# EasyEDA Pro project ProProject_aDataFlow_v2_pub_2024-01-13.epro, board PCB_back
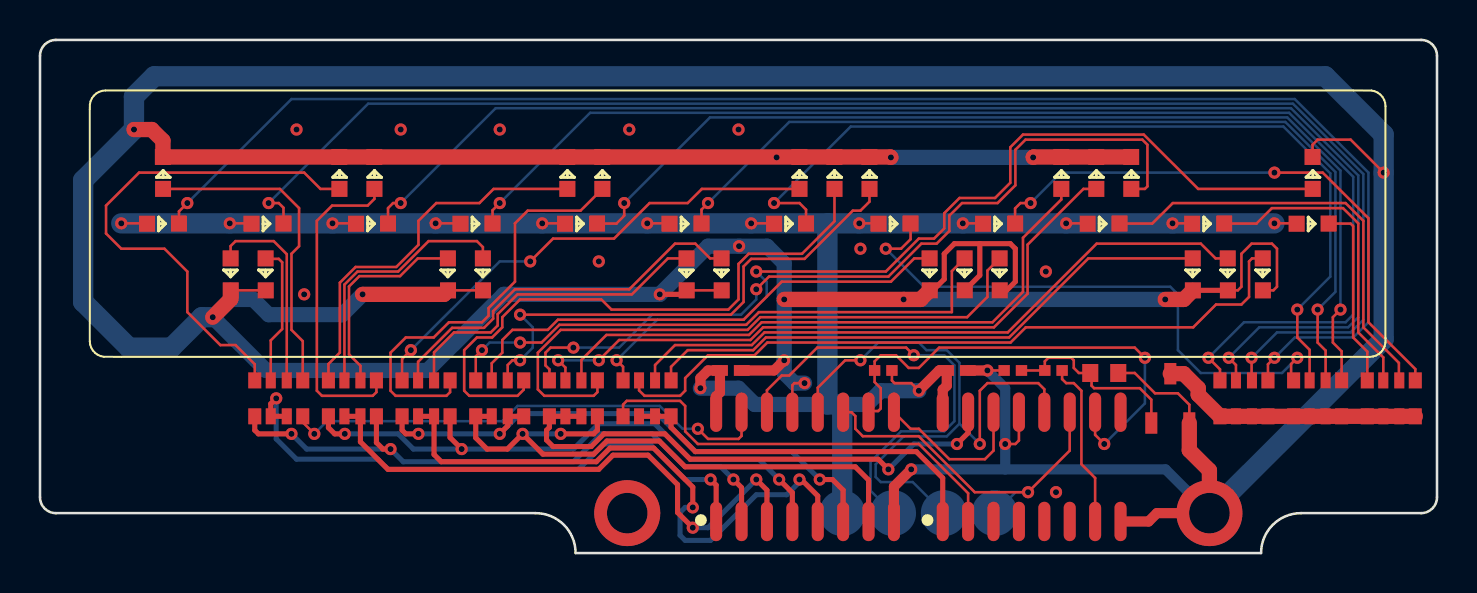
[diagram p9: board, top side]
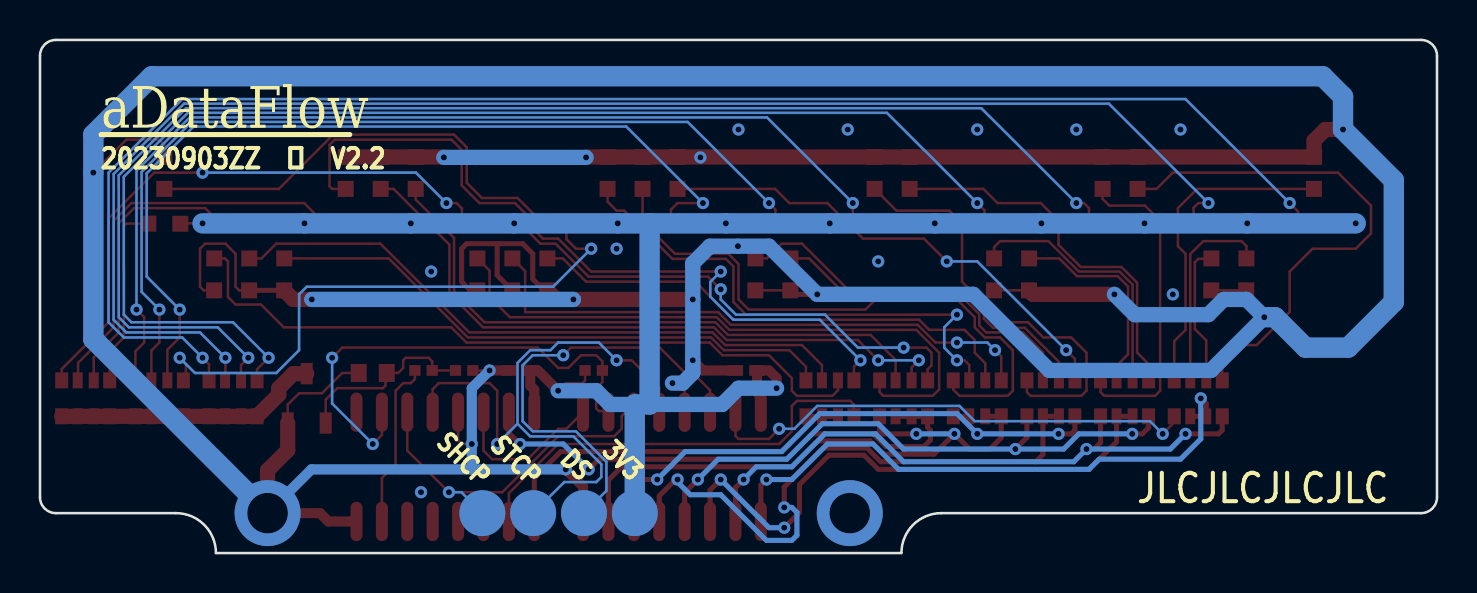
[diagram p10: board, bottom side, seen from below]

Outline 69.85 x 25.69 mm; copper layers: Top Layer, Bottom Layer. Coordinates in mm from the lower left corner of the outline.
Outline path: 0,24.9 arc(0.23,25.46) 0.79,25.69 69.06,25.69 arc(69.62,25.46) 69.85,24.9 69.85,2.79 arc(69.62,2.23) 69.06,2 63.05,2 arc(61.64,1.41) 61.05,0 26.78,0 arc(26.19,1.41) 24.78,2 0.79,2 arc(0.23,2.23) 0,2.79 0,24.9
Stack: Top Layer 0.035mm / Dielectric1 1.51mm FR4 er 4.5 / Bottom Layer 0.035mm

## Design rules (mm)
template: JLCPCB Capability(Two Layers Board)
spacing copperThickness1oz (default): track to track 0.102, other pairs 0.152 to 0.3
spacing copperThickness2oz: track to track 0.203, other pairs 0.152 to 0.3
track width copperThickness1oz (default): min 0.127, default 0.254, max 2.54
track width copperThickness2oz: min 0.203, default 0.254, max 2.54
differential pair differentialPair (default): width min 0.127, default 0.254, max 2.54; gap min 0.152, default 0.152
via viaSize (default): diameter min 0.5, default 0.61, max 10; hole min 0.3, default 0.305, max 6.3

## Placement (name value [footprint] x y rotation side)
C1  100nF  [C0402]  34.54 9.14 0 top
C2  100nF  [C0402]  45.85 9.14 180 top
C3  10uF  [C0603]  53.21 9.02 0 top
LED1  19-213/Y2C-CQ2R2L/3T(CY)  [LED0603-RD-YELLOW]  6.15 19.03 270 top
LED2  19-213/Y2C-CQ2R2L/3T(CY)  [LED0603-RD-YELLOW]  9.53 13.95 90 top
LED3  19-213/Y2C-CQ2R2L/3T(CY)  [LED0603-RD-YELLOW]  11.28 13.95 90 top
LED4  19-213/Y2C-CQ2R2L/3T(CY)  [LED0603-RD-YELLOW]  14.97 19.03 270 top
LED5  19-213/Y2C-CQ2R2L/3T(CY)  [LED0603-RD-YELLOW]  16.72 19.03 270 top
LED6  19-213/Y2C-CQ2R2L/3T(CY)  [LED0603-RD-YELLOW]  20.4 13.95 90 top
LED7  19-213/Y2C-CQ2R2L/3T(CY)  [LED0603-RD-YELLOW]  22.15 13.95 90 top
LED8  19-213/Y2C-CQ2R2L/3T(CY)  [LED0603-RD-YELLOW]  26.36 19.03 270 top
LED9  19-213/Y2C-CQ2R2L/3T(CY)  [LED0603-RD-YELLOW]  28.11 19.03 270 top
LED10  19-213/Y2C-CQ2R2L/3T(CY)  [LED0603-RD-YELLOW]  32.33 13.95 90 top
LED11  19-213/Y2C-CQ2R2L/3T(CY)  [LED0603-RD-YELLOW]  34.08 13.95 90 top
LED12  19-213/Y2C-CQ2R2L/3T(CY)  [LED0603-RD-YELLOW]  37.97 19.03 270 top
LED13  19-213/Y2C-CQ2R2L/3T(CY)  [LED0603-RD-YELLOW]  39.72 19.03 270 top
LED14  19-213/Y2C-CQ2R2L/3T(CY)  [LED0603-RD-YELLOW]  41.47 19.03 270 top
LED15  19-213/Y2C-CQ2R2L/3T(CY)  [LED0603-RD-YELLOW]  44.48 13.95 90 top
LED16  19-213/Y2C-CQ2R2L/3T(CY)  [LED0603-RD-YELLOW]  46.23 13.95 90 top
LED17  19-213/Y2C-CQ2R2L/3T(CY)  [LED0603-RD-YELLOW]  47.98 13.95 90 top
LED18  19-213/Y2C-CQ2R2L/3T(CY)  [LED0603-RD-YELLOW]  51.06 19.03 270 top
LED19  19-213/Y2C-CQ2R2L/3T(CY)  [LED0603-RD-YELLOW]  52.81 19.03 270 top
LED20  19-213/Y2C-CQ2R2L/3T(CY)  [LED0603-RD-YELLOW]  54.56 19.03 270 top
LED21  19-213/Y2C-CQ2R2L/3T(CY)  [LED0603-RD-YELLOW]  57.64 13.95 90 top
LED22  19-213/Y2C-CQ2R2L/3T(CY)  [LED0603-RD-YELLOW]  59.39 13.95 90 top
LED23  19-213/Y2C-CQ2R2L/3T(CY)  [LED0603-RD-YELLOW]  61.14 13.95 90 top
LED24  19-213/Y2C-CQ2R2L/3T(CY)  [LED0603-RD-YELLOW]  63.63 19.03 270 top
LED25  19-213/Y2C-CQ2R2L/3T(CY)  [LED0603-RD-YELLOW]  6.15 16.49 180 top
LED26  19-213/Y2C-CQ2R2L/3T(CY)  [LED0603-RD-YELLOW]  11.38 16.49 180 top
LED27  19-213/Y2C-CQ2R2L/3T(CY)  [LED0603-RD-YELLOW]  16.6 16.49 180 top
LED28  19-213/Y2C-CQ2R2L/3T(CY)  [LED0603-RD-YELLOW]  21.83 16.49 180 top
LED29  19-213/Y2C-CQ2R2L/3T(CY)  [LED0603-RD-YELLOW]  27.05 16.49 180 top
LED30  19-213/Y2C-CQ2R2L/3T(CY)  [LED0603-RD-YELLOW]  32.28 16.49 180 top
LED31  19-213/Y2C-CQ2R2L/3T(CY)  [LED0603-RD-YELLOW]  37.5 16.49 180 top
LED32  19-213/Y2C-CQ2R2L/3T(CY)  [LED0603-RD-YELLOW]  42.73 16.49 180 top
LED33  19-213/Y2C-CQ2R2L/3T(CY)  [LED0603-RD-YELLOW]  47.96 16.49 180 top
LED34  19-213/Y2C-CQ2R2L/3T(CY)  [LED0603-RD-YELLOW]  53.18 16.49 180 top
LED35  19-213/Y2C-CQ2R2L/3T(CY)  [LED0603-RD-YELLOW]  58.41 16.49 180 top
LED36  19-213/Y2C-CQ2R2L/3T(CY)  [LED0603-RD-YELLOW]  63.63 16.49 180 top
NOREF  -  [Pad_e150]  40.11 2 0 top
NOREF#2  -  [Pad_e154]  47.73 2 0 top
NOREF#3  -  [Pad_e153]  45.19 2 0 top
NOREF#4  -  [Pad_e152]  42.65 2 0 top
Q1  AO3400A  [SOT-23-3_L2.9-W1.6-P1.90-LS2.8-BR]  56.52 7.75 270 top
R1  10kΩ  [R0402]  42.16 9.14 180 top
R2  510kΩ  [R0402]  50.67 9.14 0 top
R3  510kΩ  [R0402]  48.64 9.14 0 top
RN1  1kΩ  [RES-ARRAY-SMD_0603-8P-L3.2-W1.6-BL]  11.94 7.75 0 top
RN2  1kΩ  [RES-ARRAY-SMD_0603-8P-L3.2-W1.6-BL]  15.62 7.75 0 top
RN3  1kΩ  [RES-ARRAY-SMD_0603-8P-L3.2-W1.6-BL]  19.3 7.75 0 top
RN4  1kΩ  [RES-ARRAY-SMD_0603-8P-L3.2-W1.6-BL]  22.99 7.75 0 top
RN5  1kΩ  [RES-ARRAY-SMD_0603-8P-L3.2-W1.6-BL]  26.67 7.75 0 top
RN6  1kΩ  [RES-ARRAY-SMD_0603-8P-L3.2-W1.6-BL]  30.35 7.75 0 top
RN7  1kΩ  [RES-ARRAY-SMD_0603-8P-L3.2-W1.6-BL]  60.2 7.75 0 top
RN8  1kΩ  [RES-ARRAY-SMD_0603-8P-L3.2-W1.6-BL]  63.88 7.75 0 top
RN9  1kΩ  [RES-ARRAY-SMD_0603-8P-L3.2-W1.6-BL]  67.56 7.75 0 top
U1  74HC595D,118  [SOIC-16_L9.9-W3.9-P1.27-LS6.0-BL]  38.25 4.32 0 top
U2  74HC595D,118  [SOIC-16_L9.9-W3.9-P1.27-LS6.0-BL]  49.58 4.32 0 top

## Footprints (pads in the part's own frame, mm; a bottom-side part is the same pattern mirrored in y, then rotated)
C0402
  rect 0.79x0.54 smd: 1(-0.545,0) 2(0.545,0)
C0603
  rect 0.8x0.9 smd: 1(-0.7,0) 2(0.7,0)
LED0603-RD-YELLOW
  rect 0.8x0.8 smd: 1(-0.799,-0.004) 2(0.799,0.004)
Pad_e150
  round 2.301 smd far side: 17(0,0)
Pad_e152
  round 2.301 smd far side: 17(0,0)
Pad_e153
  round 2.301 smd far side: 17(0,0)
Pad_e154
  round 2.301 smd far side: 17(0,0)
R0402
  rect 0.566x0.54 smd: 1(-0.433,0) 2(0.433,0)
RES-ARRAY-SMD_0603-8P-L3.2-W1.6-BL
  rect 0.65x0.8 smd: 1(-1.2,-0.9) 4(1.2,-0.9) 5(1.2,0.9) 8(-1.2,0.9)
  rect 0.5x0.8 smd: 2(-0.4,-0.9) 3(0.4,-0.9) 6(0.4,0.9) 7(-0.4,0.9)
SOIC-16_L9.9-W3.9-P1.27-LS6.0-BL
  oval 0.602x1.971 smd: 1(-4.445,-2.736) 2(-3.175,-2.736) 3(-1.905,-2.736) 4(-0.635,-2.736) 5(0.635,-2.736) 6(1.905,-2.736) 7(3.175,-2.736) 8(4.445,-2.736) 9(4.445,2.736) 10(3.175,2.736) 11(1.905,2.736) 12(0.635,2.736) 13(-0.635,2.736) 14(-1.905,2.736) 15(-3.175,2.736) 16(-4.445,2.736)
SOT-23-3_L2.9-W1.6-P1.90-LS2.8-BR
  rect 1.07x0.6 smd: 1(1.235,-0.95) 2(1.235,0.95) 3(-1.235,0)

## Nets
As in the schematic, except:
3V3: C1.1 C2.2 LED25.2 LED26.2 LED27.2 LED28.2 LED29.2 LED30.2 LED31.2 LED32.2 LED33.2 LED34.2 LED35.2 LED36.2 NOREF.17 R1.1 U1.16 U2.16
74HC595_DS: NOREF#4.17 U1.14
74HC595_SHCP: NOREF#2.17 U1.11 U2.11
74HC595_STCP: NOREF#3.17 U1.12 U2.12

Pads without a net: U2 3 4 5 6 9

## Via types
v1: diameter 0.61, hole 0.305, Top Layer to Bottom Layer, 98 vias
v2: diameter 3.302, hole 2.032, Top Layer to Bottom Layer, 2 vias

## Routing (per net, layer and track width the routed paths; a pad name or vN(x,y) marks a point on that pad's centre or on a via; arc(x,y) is an arc through that point)
3V3: length 107
  Top Layer w0.127: LED25.2 5.33,16.51 v1(4.06,16.51) ; LED33.2 47.14,16.51 v1(46.14,16.51) ; v1(43.94,8.13) 43.56,8.51 42.72,8.51 42.6,8.64 R1.1 ; LED26.2 10.56,16.51 v1(9.49,16.51) ; v1(61.72,16.51) 62.81,16.51 LED36.2 ; v1(19.78,16.51) 21.01,16.51 LED28.2 ; LED35.2 57.59,16.51 v1(56.63,16.51) ; LED27.2 15.78,16.51 v1(14.62,16.51) ; LED30.2 31.46,16.51 v1(30.36,16.51) ; LED34.2 52.36,16.51 v1(51.31,16.51) ; v1(25.11,16.51) 26.23,16.51 LED29.2 ; v1(35.56,16.51) 36.69,16.51 LED31.2 ; v1(40.97,16.51) 41.91,16.51 LED32.2
  Top Layer w0.508: v1(33.02,8.25) 33.02,8.76 33.4,9.14 C1.1 34,8.04 33.81,7.85 U1.16 ; U2.16 45.14,8.18 45.34,8.38 45.34,9.14 44.96,9.14 v1(43.94,8.13)
  Bottom Layer w0.762: 40.11,7.44 41.35,7.44 42.04,8.13 v1(43.94,8.13) ; v1(33.02,8.25) 34.93,8.25 35.74,7.44 39.37,7.44
  Bottom Layer w1.016: v1(61.72,16.51) v1(56.63,16.51) v1(51.31,16.51) v1(46.14,16.51) v1(40.97,16.51) 39.4,16.51 ; 39.4,16.51 v1(35.56,16.51) v1(30.36,16.51) v1(25.11,16.51) v1(19.78,16.51) v1(14.62,16.51) v1(9.49,16.51) v1(4.06,16.51) ; 39.4,16.51 39.37,16.48 39.37,7.44 40.11,7.44 NOREF.17
GND: length 312.2
  Top Layer w0.127: LED24.1 63.63,20.45 63.88,20.7 65.53,20.7 v1(67.18,19.05) ; LED7.1 LED6.1 ; LED22.1 59.89,13.16 60.07,13.33 60.07,14.99 60.58,15.49 61.59,15.49 61.85,15.24 61.85,13.33 61.67,13.16 LED23.1 ; Q1.2 57.47,7.43 56.9,8 55.75,8 54.74,9.02 C3.2 ; U2.13 48.95,5.64 48.77,5.46 v1(48.26,5.46) ; LED3.1 LED2.1 ; v1(38.23,8.51) 37.72,8.51 37.62,8.41 U1.13 ; LED10.1 LED11.1 ; R3.1 v1(47.37,9.14)
  Top Layer w0.254: LED10.1 32.13,12.95 v1(30.99,12.95) ; LED21.1 LED22.1 ; 46.99,15.49 45.72,15.49 45.21,14.99 45.21,13.72 44.65,13.16 LED15.1 ; 46.99,15.49 46.99,13.91 LED16.1 ; 46.99,15.49 48.51,15.49 48.77,15.24 48.77,13.59 48.33,13.16 47.99,13.16
  Top Layer w0.508: v1(47.37,9.14) C2.1 ; 35,9.14 36.7,9.14 v1(37.21,9.65) ; U1.8 42.7,3.33 v1(43.56,4.19) ; U2.8 55.43,1.58 55.85,2 v2(58.47,2)
  Top Layer w0.762: v1(37.21,12.7) v1(43.18,12.7) 44.03,12.7 LED15.1 ; LED20.1 LED19.1 LED18.1 49.68,19.83 v1(49.66,19.81) ; v1(8.64,11.81) 9.54,12.71 LED2.1 ; v1(56.26,12.7) 57.19,12.7 LED21.1 ; v1(16.13,12.95) 20.2,12.95 LED6.1 ; Q1.2 57.47,5.15 58.47,4.14 v2(58.47,2) ; v1(4.7,21.21) 5.59,21.21 6.15,20.65 LED1.1 LED4.1 LED5.1 LED8.1 LED9.1 LED12.1 LED14.1 42.52,19.83 v1(42.55,19.81)
  Bottom Layer w0.508: v2(58.47,2) 56.28,4.19 48.26,4.19 ; 48.26,4.19 v1(48.26,5.46) 48.26,8.25 v1(47.37,9.14) ; 48.26,4.19 v1(43.56,4.19)
  Bottom Layer w0.762: v1(38.23,8.51) 37.72,8.51 37.21,9.02 v1(37.21,9.65) v1(37.21,12.7) 37.21,14.51 36.35,15.37 v1(34.95,15.37) 33.4,15.37 v1(30.99,12.95) 23.18,12.95 19.37,9.14 11.3,9.14 v1(8.64,11.81) 9.53,12.7 10.67,12.7 11.43,11.94 15.11,11.94 v1(16.13,12.95) ; v1(56.26,12.7) v1(43.18,12.7) ; v1(49.66,19.81) v1(42.55,19.81)
  Bottom Layer w1.016: v1(8.64,11.81) 8.1,11.81 6.57,10.29 4.45,10.29 2.16,12.57 2.16,18.67 v1(4.7,21.21) 4.7,22.86 5.72,23.88 64.26,23.88 67.18,20.95 v1(67.18,19.05) 67.18,10.71 v2(58.47,2)
  vias: v1(12.83,21.21) v1(13.21,12.95) v1(18.03,21.21) v1(22.99,21.21) v1(27.94,14.61) v1(29.46,21.21) v1(34.93,21.21) v1(36.83,19.81) v1(41.02,15.24) v1(50.29,14.1) v1(50.8,3.05) v2(29.36,2)
74HC595_DS: length 22.6
  Top Layer w0.127: U1.14 36.35,8.15 37.08,8.89 37.47,8.89 38.86,10.29 43.31,10.29 v1(43.69,9.91)
  Bottom Layer w0.127: NOREF#4.17 41.53,3.12 41.53,4.57 43.05,6.1 45.21,6.1 45.72,6.6 45.72,9.4 45.21,9.91 v1(43.69,9.91)
74HC595_SHCP: length 18.3
  Top Layer w0.127: U1.11 40.57,7.05 40.77,6.86 40.77,6.22 41.14,5.85 43.93,5.85 46.74,3.05 v1(49.4,3.05) 51.49,5.13 U2.11
  Bottom Layer w0.127: NOREF#2.17 48.78,3.05 v1(49.4,3.05)
74HC595_STCP: length 31.3
  Top Layer w0.127: U2.12 50.22,8.2 49.91,8.51 47.37,8.51 46.99,8.13 v1(46.99,5.46) ; v1(41.02,9.65) 40.26,9.65 38.89,8.28 U1.12
  Bottom Layer w0.127: NOREF#3.17 43.63,3.56 42.04,3.56 41.78,3.81 41.78,4.44 43.18,5.84 45.34,5.84 45.97,6.48 ; v1(41.02,9.65) 41.91,10.54 43.94,10.54 44.32,10.16 45.34,10.16 45.97,9.52 45.97,6.48 ; 45.97,6.48 v1(46.99,5.46)
EN_BGLIGHT: length 8.5
  Top Layer w0.127: U2.7 52.76,3.76 52.07,4.44 52.07,8.13 51.69,8.51 51.31,8.51 51.11,8.71 R2.2
Q1.0: length 25
  Top Layer w0.127: v1(32.89,6.22) 33.4,5.72 34.93,5.72 35.08,5.87 U1.15 ; RN1.4 13.14,6.55 v1(13.72,5.97)
  Bottom Layer w0.127: v1(32.89,6.22) 32.13,6.22 30.99,7.37 23.88,7.37 23.11,6.6 14.35,6.6 v1(13.72,5.97)
Q1.1: length 29.7
  Top Layer w0.254: v1(11.81,7.75) 11.54,7.47 RN1.2 RN1.3 ; v1(33.53,3.68) 33.81,3.4 U1.1
  Bottom Layer w0.254: v1(33.53,3.68) 32.26,3.68 30.48,5.46 28.19,5.46 26.92,4.19 17.4,4.19 16.89,4.7 12.83,4.7 11.81,5.72 v1(11.81,7.75)
Q1.2: length 31.2
  Top Layer w0.254: RN1.1 10.74,6.15 10.92,5.97 v1(12.57,5.97) ; 16.82,6.85 16.82,5.53 17.14,5.21 v1(17.53,5.21) ; v1(34.67,3.68) 35.08,3.28 U1.2
  Bottom Layer w0.254: v1(12.57,5.97) 13.34,5.21 v1(17.53,5.21) 18.16,4.57 26.67,4.57 28.07,5.97 30.61,5.97 32.26,4.32 34.04,4.32 v1(34.67,3.68)
Q1.3: length 28.4
  Top Layer w0.254: v1(35.81,3.68) 36.35,3.15 U1.3 ; RN2.2 16.02,6.85 16.02,5.57 17.4,4.19 27.94,4.19 28.65,4.9 30.4,4.9 31.88,3.43 31.88,2.03 v1(32.64,1.27)
  Bottom Layer w0.254: v1(35.81,3.68) 33.4,1.27 v1(32.64,1.27)
Q1.4: length 29.5
  Top Layer w0.254: v1(21.08,5.21) 20.5,5.78 RN3.4 ; v1(15.24,5.97) 14.73,5.97 14.42,6.28 14.42,6.85 ; v1(36.96,3.68) 37.62,3.02 U1.4
  Bottom Layer w0.254: v1(36.96,3.68) 35.94,4.7 32.51,4.7 30.73,6.48 27.94,6.48 26.67,5.21 v1(21.08,5.21) 18.67,5.21 17.91,5.97 v1(15.24,5.97)
Q1.5: length 29.7
  Top Layer w0.254: U1.5 38.89,2.86 38.07,3.68 v1(37.97,3.68) ; RN3.2 RN3.3 19.7,4.93 20.07,4.57 27.81,4.57 28.5,5.26 30.68,5.26 32.64,3.3 v1(32.64,2.29)
  Bottom Layer w0.254: v1(32.64,2.29) 32.26,2.29 32,2.03 32,0.89 32.26,0.64 33.53,0.64 35.81,2.92 37.34,2.92 37.97,3.56 v1(37.97,3.68)
Q1.6: length 28.2
  Top Layer w0.254: v1(18.92,5.97) 18.29,5.97 18.1,6.15 RN3.1 ; v1(22.99,5.97) 23.39,6.37 RN4.3 24.19,6.85 ; v1(38.99,3.68) 39.62,3.68 40.16,3.15 U1.6
  Bottom Layer w0.254: v1(38.99,3.68) 37.59,5.08 32.77,5.08 30.86,6.98 24,6.98 v1(22.99,5.97) v1(18.92,5.97)
Q1.7: length 30.2
  Top Layer w0.254: U1.7 41.43,3.66 40.77,4.32 32.26,4.32 30.96,5.61 28.35,5.61 27.69,4.95 25.15,4.95 v1(24.13,5.97) 23.37,5.21 22.35,5.21 21.79,5.77 RN4.1 RN4.2 ; v1(26.03,5.97) 27.69,5.97 27.87,6.15 RN5.4
  Bottom Layer w0.254: v1(24.13,5.97) v1(26.03,5.97)
Q2.0: length 26.9
  Top Layer w0.254: v1(45.85,5.46) 46.41,6.02 U2.15 ; RN5.3 RN5.2 RN5.1 25.47,6.29 25.33,6.15 25.33,5.66 25.65,5.33 27.56,5.33 28.19,5.97 31.24,5.97 32.51,4.7 41.91,4.7 v1(42.42,4.19)
  Bottom Layer w0.254: v1(42.42,4.19) 43.69,5.46 v1(45.85,5.46)
Q2.1: length 19
  Top Layer w0.254: U2.1 45.14,3.76 43.81,5.08 32.77,5.08 31.55,6.29 RN6.4 RN6.3 RN6.2
Q2.2: length 22
  Top Layer w0.127: U2.2 46.41,3 43.94,5.46 32.89,5.46 32.26,6.1 32.26,7.37 32,7.62 29.34,7.62 29.15,7.44 RN6.1
$1N5946: length 8.1
  Top Layer w0.127: U2.14 47.68,5.13 47.24,4.7 45.47,4.7 43.94,6.22 43.53,6.22 U1.9
$1N13270: length 24.7
  Top Layer w0.127: U2.10 52.76,5.92 v1(53.21,5.46) ; v1(55.25,9.78) 54.74,10.29 44.96,10.29 43.94,9.27 43.43,9.27 42.8,9.91 42.04,9.91 41.73,9.6 R1.2 41.73,8.56 42.04,8.25 42.04,7.24 41.91,7.11 41.49,7.11 U1.10
  Bottom Layer w0.127: v1(55.25,9.78) 55.25,7.49 v1(53.21,5.46)
$1N16986: length 9.3
  Top Layer w0.127: LED36.1 65.53,16.5 65.66,16.37 65.66,10.8 66.36,10.09 RN9.8
$1N16996: length 15.7
  Top Layer w0.127: LED35.1 60.82,16.5 61.59,17.27 65.15,17.27 65.91,16.51 65.91,11.05 67.16,9.8 RN9.7
$1N17001: length 21.7
  Top Layer w0.127: RN9.6 67.94,8.67 67.94,9.52 66.17,11.3 66.17,16.64 65.28,17.53 56.64,17.53 55.61,16.5 LED34.1
$1N17009: length 29.2
  Top Layer w0.127: LED33.1 48.75,17.26 49.02,17.53 v1(49.53,17.53) ; RN9.5 68.76,9.21 66.42,11.56 66.42,16.76 64.13,19.05 v1(61.72,19.05)
  Bottom Layer w0.127: v1(61.72,19.05) 51.05,19.05 v1(49.53,17.53)
$1N17013: length 28.6
  Top Layer w0.127: LED32.1 43.53,15.72 43.05,15.24 v1(42.29,15.24) ; v1(62.87,9.78) 62.55,9.47 62.55,8.77 62.68,8.65
  Bottom Layer w0.127: v1(62.87,9.78) 62.1,9.02 58.04,9.02 56.9,10.16 56.9,12.95 56.52,13.33 44.2,13.33 v1(42.29,15.24)
$1N17019: length 44.1
  Top Layer w0.127: RN8.7 63.48,10.18 62.87,10.8 v1(62.87,12.19) ; v1(36.7,17.53) 37.97,17.53 38.3,17.2 LED31.1
  Bottom Layer w0.127: v1(36.7,17.53) 40.54,21.36 62.17,21.36 64.52,19.01 64.52,13.84 v1(62.87,12.19)
$1N17029: length 46.2
  Top Layer w0.127: LED30.1 33.08,17.2 v1(33.4,17.53) ; RN8.6 64.28,10.14 63.88,10.54 v1(63.88,12.19)
  Bottom Layer w0.127: v1(63.88,12.19) 64.77,13.08 64.77,19.08 62.26,21.59 37.46,21.59 v1(33.4,17.53)
$1N17039: length 51.7
  Top Layer w0.127: LED29.1 28.82,16.5 29.21,16.89 v1(29.21,17.53) ; RN8.5 65.08,10.1 64.64,10.54 64.64,11.81 v1(65.02,12.19)
  Bottom Layer w0.127: v1(29.21,17.53) 33.5,21.82 62.36,21.82 65.02,19.15 v1(65.02,12.19)
$1N17049: length 63.5
  Top Layer w0.127: LED28.1 22.63,17.16 v1(22.99,17.53) ; RN7.8 59,9.2 v1(58.42,9.78)
  Bottom Layer w0.127: v1(22.99,17.53) 27.51,22.05 62.45,22.05 65.66,18.84 65.66,11.94 65.28,11.56 60.2,11.56 v1(58.42,9.78)
$1N17059: length 68.5
  Top Layer w0.127: v1(59.44,9.78) 59.8,9.42 RN7.7 ; v1(18.03,17.53) 17.65,17.53 17.4,17.27 LED27.1
  Bottom Layer w0.127: v1(59.44,9.78) 60.96,11.3 65.41,11.3 65.91,11.81 65.91,18.91 62.55,22.27 22.78,22.27 v1(18.03,17.53)
$1N17064: length 74.7
  Top Layer w0.127: LED26.1 12.17,17.29 11.94,17.53 v1(11.43,17.53) ; v1(60.58,9.78) 60.58,8.67 RN7.6
  Bottom Layer w0.127: v1(60.58,9.78) 61.85,11.05 65.53,11.05 66.17,11.68 66.17,18.98 62.64,22.5 16.41,22.5 v1(11.43,17.53)
$1N17074: length 78.1
  Top Layer w0.127: v1(7.37,17.53) 6.95,17.11 LED25.1 ; v1(61.72,9.78) 61.4,9.45 RN7.5
  Bottom Layer w0.127: v1(7.37,17.53) 12.57,22.73 62.74,22.73 66.42,19.05 66.42,11.56 65.66,10.8 62.74,10.8 v1(61.72,9.78)
$1N17102: length 13.3
  Top Layer w0.762: RN9.4 RN9.3 RN9.2 RN9.1 RN8.4 RN8.3 RN8.2 RN7.4 RN7.3 RN7.2 RN7.1 57.91,7.93 57.91,8.25 57.19,8.98 Q1.3
$1N17396: length 16.2
  Top Layer w0.127: LED1.2 11.99,18.23 12.95,17.27 12.95,15.37 12.57,14.99 12.57,11.18 13.14,10.61 RN1.5
$1N17404: length 10.1
  Top Layer w0.127: RN1.6 12.34,14.97 11.68,15.62 9.78,15.62 9.53,15.37 LED2.2
$1N17414: length 7.1
  Top Layer w0.127: RN1.7 11.54,10.65 12.11,11.22 12.11,14.56 11.94,14.73 11.3,14.73 LED3.2
$1N17419: length 26.2
  Top Layer w0.127: LED4.2 14.02,18.23 13.21,19.05 4.95,19.05 3.3,17.4 3.3,16 4.06,15.24 6.22,15.24 7.37,14.1 7.37,12.06 9.02,10.41 9.78,10.41 10.74,9.45 RN1.8
$1N17481: length 16.1
  Top Layer w0.127: 16.82,8.65 16.82,8.06 16.64,7.87 14.1,7.87 13.84,8.13 13.84,16.64 14.61,17.4 16.38,17.4 16.72,17.74 LED5.2
$1N17484: length 10.5
  Top Layer w0.127: LED6.2 18.89,14.75 18,13.87 15.97,13.87 15.45,13.35 15.45,9.95 16.02,9.38 16.02,8.65
$1N17494: length 13.3
  Top Layer w0.127: RN2.7 15.22,13.44 15.88,14.1 17.91,14.1 19.43,15.62 21.84,15.62 22.14,15.32 LED7.2
$1N17499: length 19.2
  Top Layer w0.127: 14.42,8.65 14.42,9.47 14.99,10.04 14.99,13.54 15.78,14.33 17.81,14.33 18.92,15.44 18.92,16.64 19.81,17.53 21.97,17.53 22.68,18.23 LED8.2
$1N17561: length 21.6
  Top Layer w0.127: RN3.5 20.5,8.06 20.32,7.87 17.78,7.87 17.53,8.13 17.53,10.03 18.29,10.8 19.69,10.8 20.45,11.56 22.1,11.56 22.43,11.89 22.43,12.27 23.75,13.59 23.75,16.51 24.38,17.14 27.03,17.14 LED9.2
$1N17564: length 16.3
  Top Layer w0.127: RN3.6 19.7,10.05 20.7,11.05 22.54,11.05 22.88,11.4 22.88,11.96 23.88,12.95 29.59,12.95 31.39,14.75 LED10.2
$1N17628: length 19.1
  Top Layer w0.127: RN3.7 18.9,9.58 20.61,11.28 22.2,11.28 22.66,11.73 22.66,12.11 23.75,13.21 29.46,13.21 31.75,15.49 32.77,15.49 33.51,14.75 LED11.2
$1N17633: length 24.5
  Top Layer w0.127: v1(24.51,14.61) 25.65,15.75 28.7,15.75 30.48,17.53 32.38,17.53 33.09,18.23 LED12.2 ; v1(18.54,10.16) 18.1,9.72 RN3.8
  Bottom Layer w0.127: v1(18.54,10.16) 22.99,14.61 v1(24.51,14.61)
$1N17637: length 30.3
  Top Layer w0.127: LED13.2 39.72,16.61 38.1,14.99 35.43,14.99 34.93,14.48 34.93,12.7 34.42,12.19 28.57,12.19 28.07,12.7 24,12.7 23.11,11.81 23.11,11.3 22.61,10.8 21.84,10.8 21.21,10.16 21.21,8.13 21.46,7.87 23.88,7.87 24.19,8.18 24.19,8.65
$1N17659: length 25.8
  Top Layer w0.127: v1(24,9.65) 23.62,9.65 23.39,9.42 RN4.6 ; LED14.2 41.47,17.6 41.02,17.14 40.64,17.14 38.23,14.73 35.56,14.73 35.18,14.35 35.18,12.57 34.54,11.94 v1(24,11.94)
  Bottom Layer w0.127: v1(24,9.65) 24.64,10.29 24.64,11.3 v1(24,11.94)
$1N17663: length 25.3
  Top Layer w0.127: RN4.7 22.59,9.51 23.11,10.03 23.11,10.67 23.62,11.18 25.39,11.18 25.9,11.68 35.18,11.68 37.08,13.59 42.55,13.59 43.71,14.75 LED15.2
$1N17673: length 28.9
  Top Layer w0.127: v1(24,10.54) 25.08,10.54 25.97,11.43 35.31,11.43 35.94,12.06 45.59,12.06 45.59,14.12 LED16.2 ; RN4.8 21.79,9.85 v1(22.1,10.16)
  Bottom Layer w0.127: v1(24,10.54) 22.48,10.54 v1(22.1,10.16)
$1N17745: length 31.4
  Top Layer w0.127: RN5.5 27.87,8.06 27.69,7.87 25.21,7.87 24.89,8.19 24.89,10.03 26.03,11.18 35.38,11.18 36.02,11.81 46.35,11.81 47.37,12.83 47.37,14.15 LED17.2
$1N17748: length 30.5
  Top Layer w0.127: RN5.6 27.07,9.67 28.32,10.92 35.45,10.92 36.09,11.56 47.62,11.56 49.15,13.08 49.15,15.79 51.06,17.7 51.06,18.23
$1N17752: length 33.1
  Top Layer w0.127: v1(27.94,9.65) 28.96,10.67 35.52,10.67 36.16,11.3 47.69,11.3 49.38,12.99 49.38,15.44 52.17,18.23 LED19.2 ; RN5.7 26.27,9.29 v1(25.91,9.65)
  Bottom Layer w0.127: v1(25.91,9.65) v1(27.94,9.65)
$1N17828: length 40.8
  Top Layer w0.127: v1(35.81,13.21) 36.45,13.84 42.42,13.84 44.07,15.49 44.83,15.49 45.47,16.13 45.47,16.89 46.1,17.53 47.88,17.53 48.77,18.41 48.77,20.19 49.28,20.7 55.12,20.7 55.37,20.45 55.37,18.36 55.25,18.23 LED20.2 ; RN5.8 25.47,9.2 25.27,9.4 25.27,10.03 25.53,10.29 v1(26.67,10.29)
  Bottom Layer w0.127: v1(35.81,13.21) 35.81,12.7 35.05,11.94 30.61,11.94 28.96,10.29 v1(26.67,10.29)
$1N17838: length 29
  Top Layer w0.127: RN6.5 31.55,9.33 32.38,10.16 35.66,10.16 36.29,10.8 48.46,10.8 52.42,14.75 LED21.2
$1N17848: length 32.2
  Top Layer w0.127: LED22.2 58.78,14.75 58.04,15.49 52.83,15.49 48.39,11.05 36.22,11.05 35.59,10.41 31.75,10.41 30.75,9.42 RN6.6
$1N17875: length 36.1
  Top Layer w0.127: RN6.7 29.95,8.15 30.23,7.87 32,7.87 32.26,8.13 32.26,8.76 33.4,9.91 35.73,9.91 36.36,10.54 48.53,10.54 49.29,11.3 57.66,11.3 58.8,12.45 60.07,12.45 60.45,12.83 60.45,14.61 60.6,14.75 LED23.2
$1N23289: length 9.6
  Top Layer w0.127: R3.2 R2.1 50.24,9.6 50.42,9.78 51.56,9.78 51.69,9.65 51.69,9.27 51.94,9.02 C3.1 52.58,8.95 52.58,8.38 52.71,8.25 54.99,8.25 55.56,7.68 55.56,6.51
$1N26698: length 44.7
  Top Layer w0.127: v1(35.81,14.1) 42.29,14.1 43.94,15.75 44.7,15.75 45.21,16.26 45.21,17.02 45.97,17.78 47.75,17.78 48.51,18.54 48.51,20.32 49.15,20.95 55.19,20.95 57.91,18.23 LED24.2 ; v1(28.83,9.65) 29.15,9.33 RN6.8
  Bottom Layer w0.127: v1(28.83,9.65) 30.86,11.68 35.18,11.68 36.34,12.84 36.34,13.58 v1(35.81,14.1)

## Copper pours and planes (outline as drawn; the poured copper is in the pictures)
GND on Top Layer: -1.65,27.3 74.93,27.3 74.93,-1.65 -1.65,-1.65
GND on Bottom Layer: -0.63,29.21 70.99,29.21 70.99,-5.21 -0.63,-5.21

## Text on the board
Bottom Silkscreen Layer: 3V3 | DS | STCP | SHCP | JLCJLCJLCJLC | 20230903ZZ  ⭐️  V2.2 | aDataFlow
